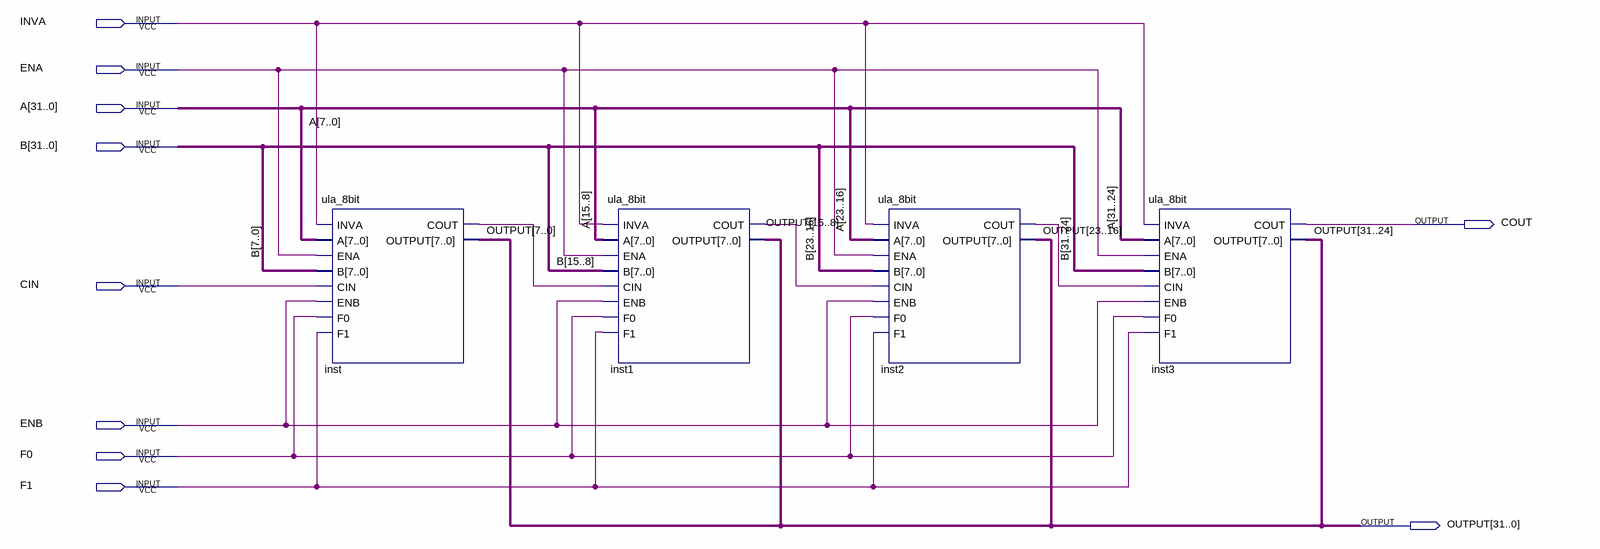
[diagram p0: schematic sheet]
// Quartus schematic ULA_32bit.bdf as structural Verilog: 4 symbols, 10 pins
module ULA_32bit (
  input  INVA,
  input  ENA,
  input  [31:0] A,
  input  [31:0] B,
  input  CIN,
  input  ENB,
  input  F0,
  input  F1,
  output COUT,
  output [31:0] OUTPUT
);

  wire inst1_cout, inst2_cout, inst_cout;

  ula_8bit inst (
    .INVA(INVA), .A(A[7:0]), .ENA(ENA), .B(B[7:0]), .CIN(CIN), .ENB(ENB), .F0(F0), .F1(F1), .COUT(inst_cout),
    .OUTPUT(OUTPUT[7:0]));
  ula_8bit inst1 (
    .INVA(INVA), .A(A[15:8]), .ENA(ENA), .B(B[15:8]), .CIN(inst_cout), .ENB(ENB), .F0(F0), .F1(F1),
    .COUT(inst1_cout), .OUTPUT(OUTPUT[15:8]));
  ula_8bit inst2 (
    .INVA(INVA), .A(A[23:16]), .ENA(ENA), .B(B[23:16]), .CIN(inst1_cout), .ENB(ENB), .F0(F0), .F1(F1),
    .COUT(inst2_cout), .OUTPUT(OUTPUT[23:16]));
  ula_8bit inst3 (
    .INVA(INVA), .A(A[31:24]), .ENA(ENA), .B(B[31:24]), .CIN(inst2_cout), .ENB(ENB), .F0(F0), .F1(F1),
    .COUT(COUT), .OUTPUT(OUTPUT[31:24]));
endmodule
